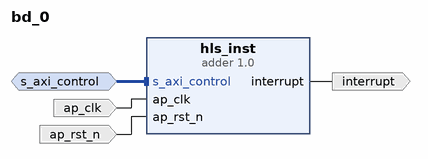
[diagram p0: block diagram of the top level]
# Vivado block design bd_0, xc7s50csga324-1, Vivado 2024.2
create_bd_design bd_0

create_bd_intf_port -mode Slave -vlnv xilinx.com:interface:aximm_rtl:1.0 s_axi_control
set_property -dict [list \
  CONFIG.ADDR_WIDTH 32 \
  CONFIG.ARUSER_WIDTH 0 \
  CONFIG.AWUSER_WIDTH 0 \
  CONFIG.BUSER_WIDTH 0 \
  CONFIG.DATA_WIDTH 32 \
  CONFIG.FREQ_HZ 50000000.0 \
  CONFIG.HAS_BRESP 1 \
  CONFIG.HAS_BURST 0 \
  CONFIG.HAS_CACHE 0 \
  CONFIG.HAS_LOCK 0 \
  CONFIG.HAS_PROT 0 \
  CONFIG.HAS_QOS 0 \
  CONFIG.HAS_REGION 0 \
  CONFIG.HAS_RRESP 1 \
  CONFIG.HAS_WSTRB 1 \
  CONFIG.ID_WIDTH 0 \
  CONFIG.NUM_READ_OUTSTANDING 1 \
  CONFIG.NUM_READ_THREADS 1 \
  CONFIG.NUM_WRITE_OUTSTANDING 1 \
  CONFIG.NUM_WRITE_THREADS 1 \
  CONFIG.PROTOCOL AXI4LITE \
  CONFIG.READ_WRITE_MODE READ_WRITE \
  CONFIG.RUSER_BITS_PER_BYTE 0 \
  CONFIG.RUSER_WIDTH 0 \
  CONFIG.WUSER_BITS_PER_BYTE 0 \
  CONFIG.WUSER_WIDTH 0 \
] [get_bd_intf_ports s_axi_control]
create_bd_port -dir I -type clk ap_clk
set_property -dict {CONFIG.FREQ_HZ 50000000.0} [get_bd_ports ap_clk]
create_bd_port -dir I -type rst ap_rst_n
create_bd_port -dir O -type intr interrupt

create_bd_cell -type ip -vlnv xilinx.com:hls:adder:1.0 hls_inst

# ---- connections ----

connect_bd_intf_net -intf_net s_axi_control_0_1 [get_bd_intf_ports s_axi_control] [get_bd_intf_pins hls_inst/s_axi_control]
connect_bd_net -net ap_clk_0_1 [get_bd_ports ap_clk] [get_bd_pins hls_inst/ap_clk]
connect_bd_net -net ap_rst_n_0_1 [get_bd_ports ap_rst_n] [get_bd_pins hls_inst/ap_rst_n]
connect_bd_net [get_bd_pins hls_inst/interrupt] [get_bd_ports interrupt]

# ---- address map ----
assign_bd_address -offset 0x00000000 -range 64K -target_address_space [get_bd_addr_spaces s_axi_control] [get_bd_addr_segs hls_inst/s_axi_control/Reg]

validate_bd_design
save_bd_design
